# Altium schematic sheet 5V_Buck.SchDoc
size 259 x 167 mm; SheetNumber: 3; SheetTotal: 7
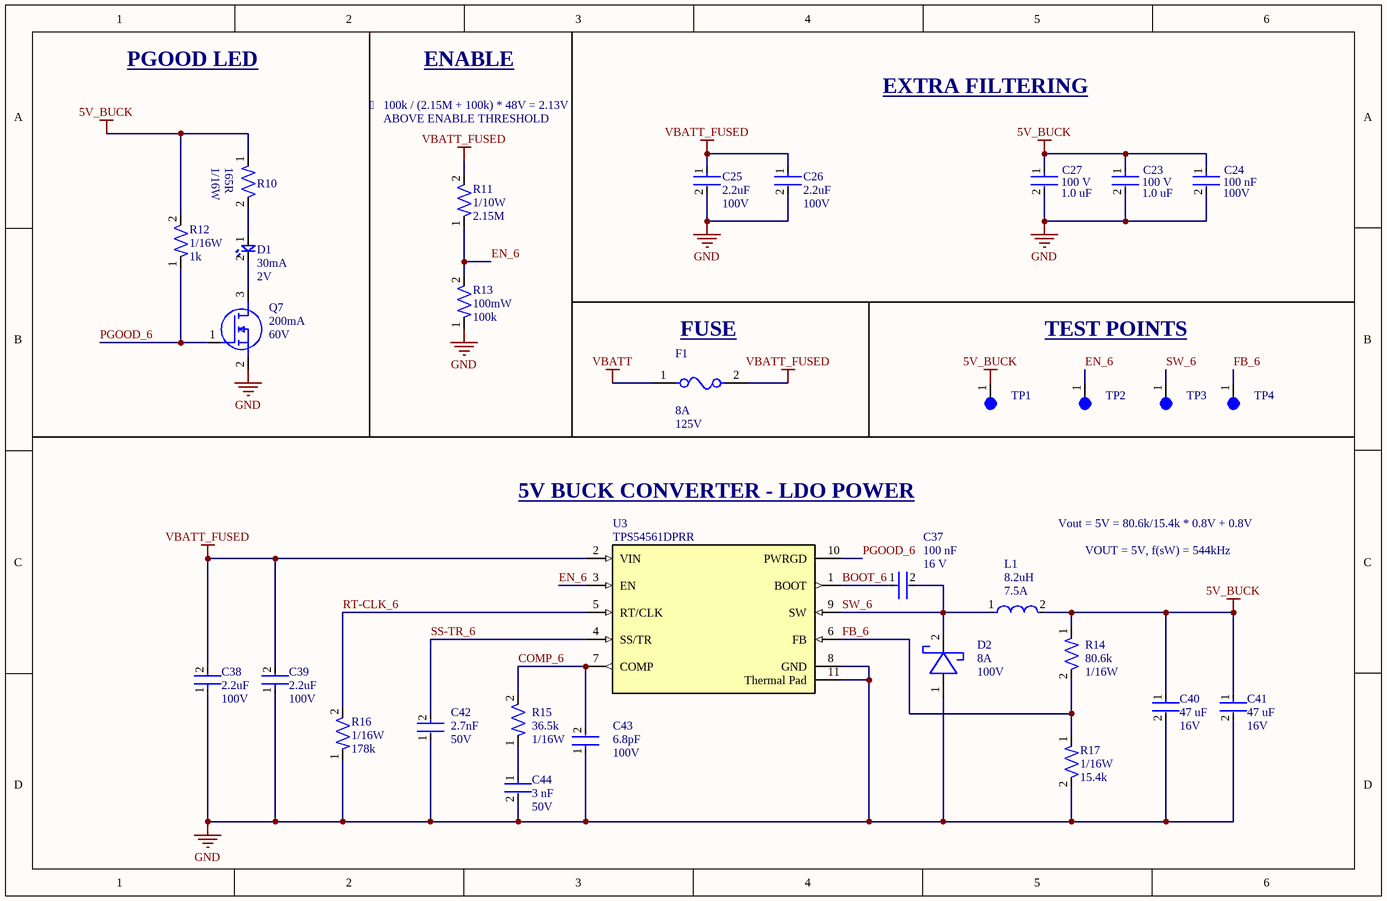
[diagram p0: 5V_Buck.SchDoc]

## Parts
C23  Voltage: 100 V  Capacitance: 1.0 uF  [CAP-0805]  (hidden comment: 08051C105K4Z2A)
C24  Capacitance: 100 nF  Voltage: 100V  [CAP-0603]  (hidden comment: GRM188R72A104KA35D)
C25  Capacitance: 2.2uF  Voltage: 100V  [CAP-1206]  (hidden comment: CC1206KKX7R0BB225)
C26  Capacitance: 2.2uF  Voltage: 100V  [CAP-1206]  (hidden comment: CC1206KKX7R0BB225)
C27  Voltage: 100 V  Capacitance: 1.0 uF  [CAP-0805]  (hidden comment: 08051C105K4Z2A)
C37  Voltage Rating: 16 V  Capacitance: 100 nF  [CAP-0402]  (hidden comment: CC0402KRX7R7BB104)
C38  Capacitance: 2.2uF  Voltage: 100V  [CAP-1206]  (hidden comment: CC1206KKX7R0BB225)
C39  Capacitance: 2.2uF  Voltage: 100V  [CAP-1206]  (hidden comment: CC1206KKX7R0BB225)
C40  Capacitance: 47 uF  Voltage: 16V  [CAP-1210]  (hidden comment: GRM32ER61C476KE15L)
C41  Capacitance: 47 uF  Voltage: 16V  [CAP-1210]  (hidden comment: GRM32ER61C476KE15L)
C42  Voltage: 50V  Capacitance: 2.7nF  [CAP-0805]  (hidden comment: GRM2165C1H272JA01D)
C43  Voltage: 100V  Capacitance: 6.8pF  [CAP-0603]  (hidden comment: CC0603CRNPO0BN6R8)
C44  Voltage: 50V  Capacitance: 3 nF  [CAP-0603]  (hidden comment: GRM1885C1H302JA01D)
D1  Forward Current: 30mA  Forward Voltage: 2V  [LED-0603]  (hidden comment: BL-HKC36G-AV-TRB)
D2  Forward Current: 8A  Reverse Voltage (DC): 100V  [DO-POWERDI5]  (hidden comment: SDT8A100P5-7)
F1  Fuse Current: 8A  Voltage Rating: 125V  [FUSE-0001]  (hidden comment: 01550900M)
L1  Inductance: 8.2uH  Current Rating: 7.5A  [IND25X25CZ]  (hidden comment: IHLP2525CZER8R2M01)
Q7  Continuous Current: 200mA  Voltage: 60V  [IC-SOT23-3]  (hidden comment: T2N7002AK,LM)
R10  RC0402FR-07165RL  [RES-0402]  (value not drawn)
R11  Power: 1/10W  Resistance: 2.15M  [RES-0603]  (hidden comment: RC0603FR-072M15L)
R12  Power: 1/16W  Resistance: 1k  [RES-0402]  (hidden comment: RC0402FR-071KL)
R13  Power: 100mW  Resistance: 100k  [RES-0603]  (hidden comment: RC0603FR-07100KL)
R14  Resistance: 80.6k  Power: 1/16W  [RES-0402]  (hidden comment: RC0402FR-0780K6L)
R15  Power: 1/16W  Resistance: 36.5k  [RES-0402]  (hidden comment: RC0402FR-0736K5L)
R16  Power: 1/16W  Resistance: 178k  [RES-0402]  (hidden comment: RTT021783FTH)
R17  Power: 1/16W  Resistance: 15.4k  [RES-0402]  (hidden comment: AC0402FR-0715K4L)
TP1  5003  [TEST-POINT-0001]  (value not drawn)
TP2  5003  [TEST-POINT-0001]  (value not drawn)
TP3  5003  [TEST-POINT-0001]  (value not drawn)
TP4  5003  [TEST-POINT-0001]  (value not drawn)
U3  TPS54561DPRR  [IC-10WSON]

## Nets
5V_BUCK: C23.1 C24.1 C27.1 C40.1 C41.1 L1.2 R10.1 R12.2 R14.1 TP1.1
GND: C23.2 C24.2 C25.2 C26.2 C27.2 C38.1 C39.1 C40.2 C41.2 C42.1 C43.1 C44.2 D2.1(CATHODE) Q7.2(S) R13.1 R16.1 R17.2 U3.8(GND) U3.11(Thermal_Pad)
VBATT: F1.1
VBATT_FUSED: C25.1 C26.1 C38.2 C39.2 F1.2 R11.2 U3.2(VIN)
BOOT_6: C37.1 U3.1(BOOT)
COMP_6: C43.2 R15.2 U3.7(COMP)
EN_6: R11.1 R13.2 TP2.1 U3.3(EN)
FB_6: R14.2 R17.1 TP4.1 U3.6(FB)
PGOOD_6: Q7.1(G) R12.1 U3.10(PWRGD)
RT-CLK_6: R16.2 U3.5(RT/CLK)
SS-TR_6: C42.2 U3.4(SS/TR)
SW_6: C37.2 D2.2(ANODE) L1.1 TP3.1 U3.9(SW)
NetC44_1: C44.1 R15.1
NetD1_1: D1.1 R10.2
NetD1_2: D1.2 Q7.3(D)

## Notes on the sheet
- PGOOD LED
- 
- 100k / (2.15M + 100k) * 48V = 2.13V
- ENABLE
- EXTRA FILTERING
- ABOVE ENABLE THRESHOLD
- (near F1) FUSE
- TEST POINTS
- 5V BUCK CONVERTER - LDO POWER
- Vout = 5V = 80.6k/15.4k * 0.8V + 0.8V
- VOUT = 5V, f(sW) = 544kHz
- (in symbol RES-165-0001) 1/16W; 165R

## Library data of the parts
C23 C27 = CAP-1U-0001: CAP CER 1UF 50V X7R 0805; ComponentLink2URL: https://www.yageo.com/upload/media/product/productsearch/datasheet/mlcc/UPY-GPHC_X7R_6.3V-to-250V_24.pdf; ComponentLink2Description: Datasheet; Device Class: Ceramic; Size: 0805
C24 = CAP-1U-0002: CAP CER 100NF 100V X7R 0603; Device Class: Ceramic; Size: 0603
C25 C26 C38 C39 = CAP-2.2U-0001: CAP CER 2.2UF 100V X7R 1206; Device Class: Ceramic; Size: 1206; ComponentLink1Description: Datasheet; ComponentLink1URL: https://www.yageo.com/upload/media/product/productsearch/datasheet/mlcc/UPY-GPHC_X7R_6.3V-to-250V_24.pdf
C37 = CAP-0.1U-0001: CAP CER 0.1UF 16V X7R 0402; ComponentLink2Description: Datasheet; ComponentLink2URL: https://www.yageo.com/upload/media/product/productsearch/datasheet/mlcc/UPY-GPHC_X7R_6.3V-to-250V_24.pdf; Device Class: Ceramic; Size: 0402
C40 C41 = CAP-47U-0002: CAP CER 47UF 16V X5R 1210; Device Class: Ceramic; Size: 1210; ComponentLink1Description: Datasheet; ComponentLink1URL: https://search.murata.co.jp/Ceramy/image/img/A01X/G101/ENG/GRM32ER61C476KE15-01.pdf
C42 = CAP-2.7N-0001: CAP CER 2700PF 50V C0G/NP0 0805; ComponentLink1Description: Datasheet; ComponentLink1URL: https://search.murata.co.jp/Ceramy/image/img/A01X/G101/ENG/GRM2165C1H272JA01-01.pdf; Device Class: Ceramic; Size: 0805
C43 = CAP-6.8P-0001: CAP CER 6.8PF 100V C0G/NPO 0603; Device Class: Ceramic; ComponentLink1Description: Datasheet; ComponentLink1URL: https://www.yageo.com/upload/media/product/productsearch/datasheet/mlcc/UPY-GPHC_X7R_6.3V-to-250V_24.pdf; Size: 0603
C44 = CAP-3N-0001: 3000 pF ±5% 50V Ceramic Capacitor C0G, NP0 0603 (1608 Metric); Device Class: Ceramic; Size: 1210; ComponentLink1Description: Datasheet; ComponentLink1URL: https://mm.digikey.com/Volume0/opasdata/d220001/medias/docus/41/CL32B106KBJNNNE_Spec.pdf
D1 = LED-0001: LED YELLOW CLEAR 0603 SMD; ComponentLink1Description: Datasheet; ComponentLink1URL: https://www.americanbrightled.com/pdffiles/led-components/smt/BL-HKC36G-AV-TRB.pdf
D2 = DIO-SCHOTTKY-0001: DIODE SCHOTTKY 100V 8A POWERDI5; ComponentLink1Description: Datasheet; ComponentLink1URL: https://www.diodes.com/assets/Datasheets/PDS760.pdf
F1 = FUSE-0001: FUSE BLOK CARTRIDGE 125V 10A SMD; ComponentLink2Description: Datasheet; ComponentLink2URL: https://www.littelfuse.com/~/media/electronics/datasheets/fuses/littelfuse_fuse_154_154t_154l_154tl_datasheet.pdf.pdf
L1 = IND-8.2U-0001: 8.2 µH Shielded Molded Inductor 4 A 68mOhm Max Nonstandard; ComponentLink1Description: Datasheet; ComponentLink1URL: https://products.sumida.com/products/pdf/CDRH104.pdf
Q7 = NMOS-200MA-0001: MOSFET N-CH 60V 200MA SOT23; ComponentLink1Description: Datasheet; ComponentLink1URL: https://toshiba.semicon-storage.com/info/T2N7002AK_datasheet_en_20150401.pdf?did=29712&prodName=T2N7002AK
R10 = RES-165-0001: RES 165 OHM 1% 1/16W 0402; Package: None; Price: None; Value: *; MP: RC0402FR-07165RL; Availability: Unavailable
R11 = RES-2.15M-0001: RES SMD 2.15M OHM 1% 1/10W 0603; Tolerance: 1%; Size: 0603; ComponentLink1Description: Datasheet; ComponentLink1URL: https://www.yageo.com/upload/media/product/products/datasheet/rchip/PYu-RC_Group_51_RoHS_L_12.pdf
R12 = RES-1k-0001: RES 1K OHM 1% 1/16W 0402; Tolerance: 1%; Size: 0402; ComponentLink1Description: Datasheet; ComponentLink1URL: https://www.yageo.com/upload/media/product/products/datasheet/rchip/PYu-RC_Group_51_RoHS_L_12.pdf
R13 = RES-100k-0001: RES SMD 100K OHM 1% 1/10W 0603; Tolerance: 1%; Size: 0603; ComponentLink1Description: Datasheet; ComponentLink1URL: https://www.yageo.com/upload/media/product/products/datasheet/rchip/PYu-RC_Group_51_RoHS_L_12.pdf
R14 = RES-80.6k-0001: 80.6 kOhms ±1% 0.063W, 1/16W Chip Resistor 0402 (1005 Metric) Moisture Resistant Thick Film; Tolerance: 1%; Size: 0402; ComponentLink1Description: Datasheet; ComponentLink1URL: https://www.yageo.com/upload/media/product/products/datasheet/rchip/PYu-RC_Group_51_RoHS_L_12.pdf
R15 = RES-36.5k-0001: 36.5 kOhms ±1% 0.063W, 1/16W Chip Resistor 0402 (1005 Metric) Moisture Resistant Thick Film; Parameter 1: *
R16 = RES-178k-0001_1: 62.5mW Thick Film Resistors 50V ±100ppm/℃ ±1% 178kΩ 0402 Chip Resistor - Surface Mount ROHS; Tolerance: 1%; Size: 0402; ComponentLink1Description: Datasheet; ComponentLink1URL: https://www.lcsc.com/datasheet/lcsc_datasheet_2304140030_RALEC-RTT021783FTH_C102842.pdf
R17 = RES-15.4K-0001: RES 15.4kΩ ±1% 0.063W 0402; Tolerance: 1%; Size: 0402; ComponentLink1Description: Datasheet; ComponentLink1URL: https://www.yageo.com/upload/media/product/productsearch/datasheet/rchip/PYu-AC_51_RoHS_L_10.pdf
TP1-TP4 = TEST-POINT-0001: Oranange PC Test Point, Miniature Phoisphor Bronze Silver Plating Through Hole Mounting Type
U3 = IC-BUCK-0001: IC REG BUCK ADJ 5A 10WSON; ComponentLink1Description: Datasheet; ComponentLink1URL: https://www.ti.com/general/docs/suppproductinfo.tsp?distId=10&gotoUrl=https%3A%2F%2Fwww.ti.com%2Flit%2Fgpn%2Ftps54561